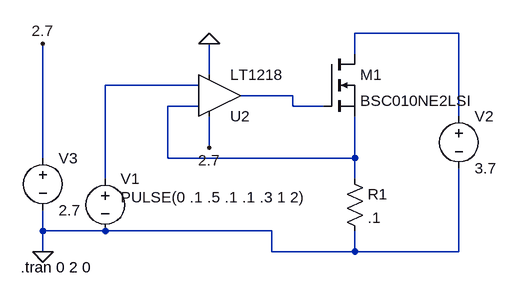
[diagram p0: schematic simulation.asc]
simulation.asc, the LTspice schematic file:
Version 4
SHEET 1 880 680
WIRE 528 0 368 0
WIRE 368 32 368 0
WIRE 144 64 144 16
WIRE 128 80 -16 80
WIRE 272 96 192 96
WIRE 128 112 80 112
WIRE 272 112 272 96
WIRE 320 112 272 112
WIRE 528 128 528 0
WIRE 144 176 144 128
WIRE -112 192 -112 16
WIRE 80 192 80 112
WIRE 368 192 368 128
WIRE 368 192 80 192
WIRE -16 224 -16 80
WIRE 368 224 368 192
WIRE -112 304 -112 272
WIRE -16 304 -112 304
WIRE 240 304 -16 304
WIRE -112 336 -112 304
WIRE 240 336 240 304
WIRE 368 336 368 304
WIRE 368 336 240 336
WIRE 528 336 528 208
WIRE 528 336 368 336
FLAG -112 336 0
FLAG -112 16 2.7
FLAG 144 176 2.7
FLAG 144 16 0
SYMBOL voltage -16 208 R0
WINDOW 3 24 44 Left 2
WINDOW 123 0 0 Left 2
WINDOW 39 0 0 Left 2
SYMATTR InstName V1
SYMATTR Value PULSE(0 .1 .5 .1 .1 .3 1 2)
SYMBOL res 352 208 R0
SYMATTR InstName R1
SYMATTR Value .1
SYMBOL nmos 320 32 R0
SYMATTR InstName M1
SYMATTR Value BSC010NE2LSI
SYMBOL voltage 528 112 R0
WINDOW 123 0 0 Left 2
WINDOW 39 0 0 Left 2
SYMATTR InstName V2
SYMATTR Value 3.7
SYMBOL voltage -112 176 R0
WINDOW 123 0 0 Left 2
WINDOW 39 0 0 Left 2
SYMATTR InstName V3
SYMATTR Value 2.7
SYMBOL Opamps\\LT1218 160 96 M180
SYMATTR InstName U2
TEXT -146 360 Left 2 !.tran 0 2 0

The netlist it stands for:
* simulation.asc
V1 N002 0 PULSE(0 .1 .5 .1 .1 .3 1 2)
R1 N004 0 .1
M1 N001 N003 N004 N004 BSC010NE2LSI
V2 N001 0 3.7
V3 2.7 0 2.7
XU2 N002 N004 2.7 0 N003 NC_01 LT1218
.model NMOS NMOS
.model PMOS PMOS
.lib standard.mos
.tran 0 2 0
.lib LTC.lib
.backanno
.end